# EasyEDA schematic Shield_Amir_EDO_V_0_0.json
TITLE: For EDO (DROP SCREEN exhibit, 3D exhebition); REV: 1.0; Date: 2023-11-01; Sheet: 1/1; Company: Amir BS
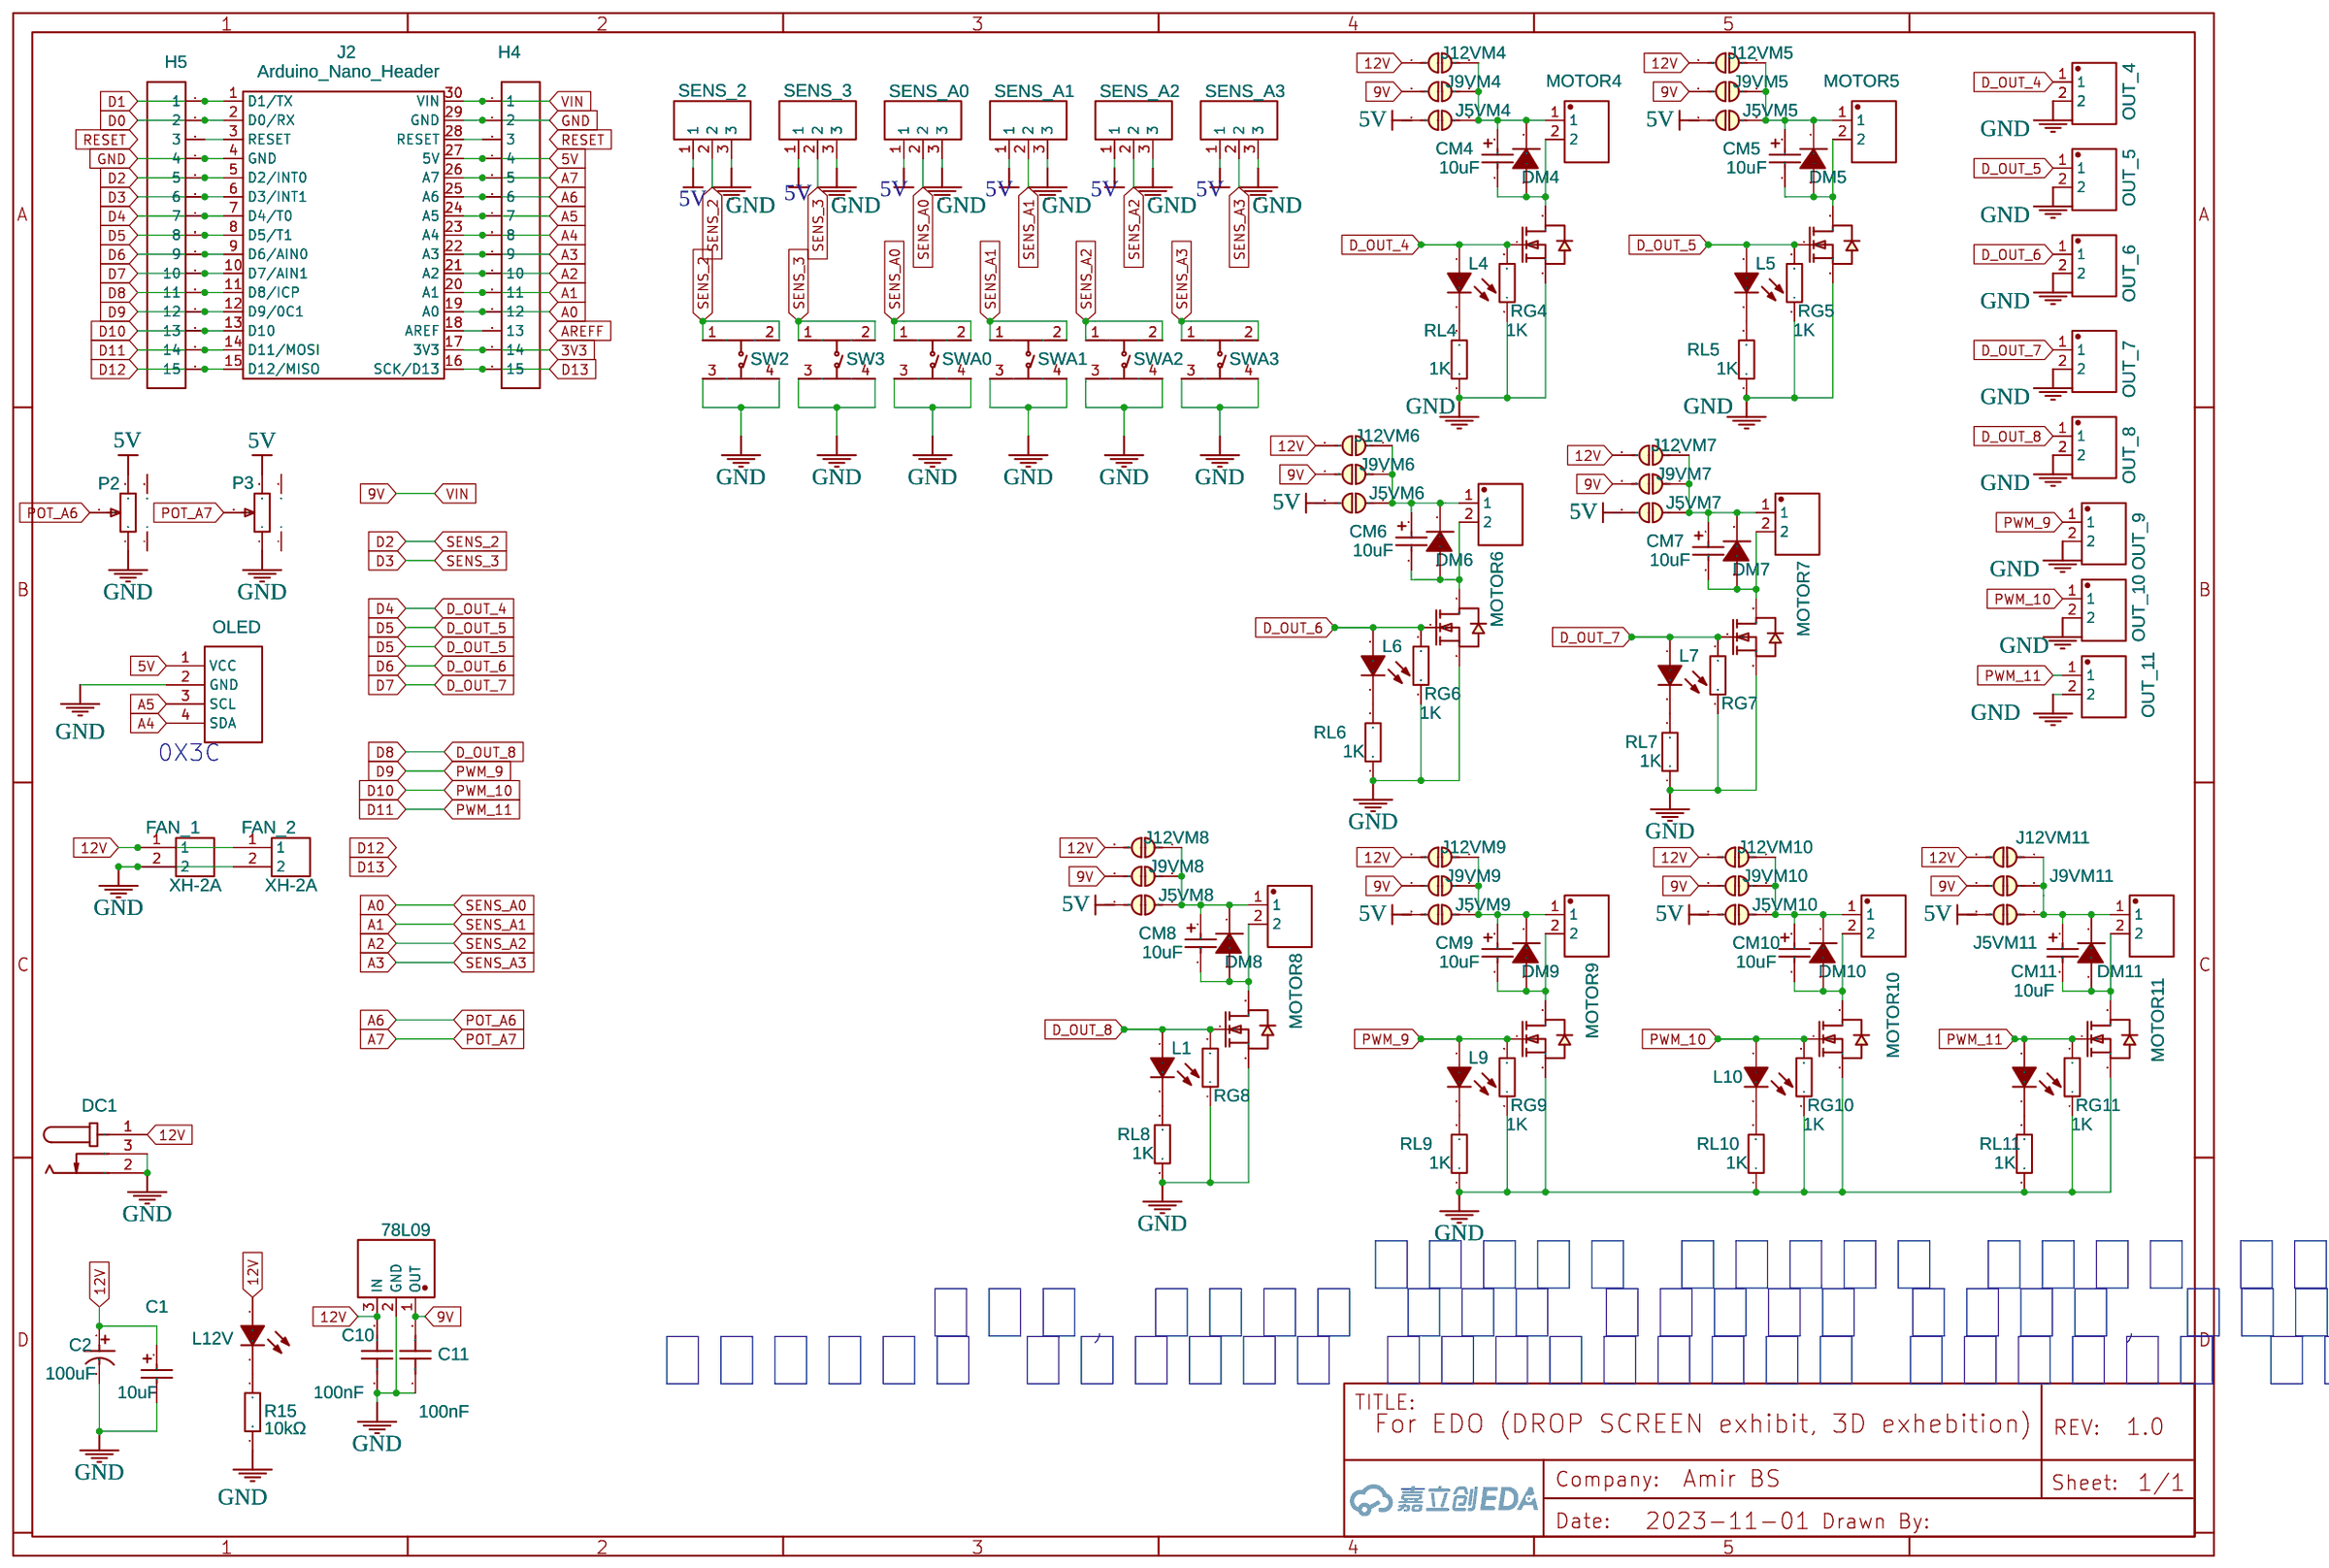
[diagram p0: schematic sheet]

## Parts
C1  10uF  [CAP-SMD_L3.2-W1.6-RD-C7171]
C2  100uF  [CAP-TH_BD6.3-P2.50-D1.0-FD]
C10  100nF  [C0603]
C11  100nF  [C0603]
CM4  10uF  [CAP-SMD_L3.2-W1.6-RD-C7171]
CM5  10uF  [CAP-SMD_L3.2-W1.6-RD-C7171]
CM6  10uF  [CAP-SMD_L3.2-W1.6-RD-C7171]
CM7  10uF  [CAP-SMD_L3.2-W1.6-RD-C7171]
CM8  10uF  [CAP-SMD_L3.2-W1.6-RD-C7171]
CM9  10uF  [CAP-SMD_L3.2-W1.6-RD-C7171]
CM10  10uF  [CAP-SMD_L3.2-W1.6-RD-C7171]
CM11  10uF  [CAP-SMD_L3.2-W1.6-RD-C7171]
DC1  DC  [DC-IN-TH_DC005]
DM4  1N4007  [SMAF_L3.5-W2.6-LS4.7-RD]
DM5  1N4007  [SMAF_L3.5-W2.6-LS4.7-RD]
DM6  1N4007  [SMAF_L3.5-W2.6-LS4.7-RD]
DM7  1N4007  [SMAF_L3.5-W2.6-LS4.7-RD]
DM8  1N4007  [SMAF_L3.5-W2.6-LS4.7-RD]
DM9  1N4007  [SMAF_L3.5-W2.6-LS4.7-RD]
DM10  1N4007  [SMAF_L3.5-W2.6-LS4.7-RD]
DM11  1N4007  [SMAF_L3.5-W2.6-LS4.7-RD]
FAN_1  XH-2A  [CONN-TH_XH-2A]
FAN_2  XH-2A  [CONN-TH_XH-2A]
H4  HDR-F-2.54_1x15  [HDR-F-2.54_1X15]
H5  HDR-F-2.54_1x15  [HDR-F-2.54_1X15]
J2  Arduino_Nano_Header  [DIP-30_L43.18-W15.24-ARDUINONANO]
J5VM4  JUMPER-SMT_2  [JUMPERS_SMT-JUMPER_2_NC_PASTE_NO-SILK]
J5VM5  JUMPER-SMT_2  [JUMPERS_SMT-JUMPER_2_NC_PASTE_NO-SILK]
J5VM6  JUMPER-SMT_2  [JUMPERS_SMT-JUMPER_2_NC_PASTE_NO-SILK]
J5VM7  JUMPER-SMT_2  [JUMPERS_SMT-JUMPER_2_NC_PASTE_NO-SILK]
J5VM8  JUMPER-SMT_2  [JUMPERS_SMT-JUMPER_2_NC_PASTE_NO-SILK]
J5VM9  JUMPER-SMT_2  [JUMPERS_SMT-JUMPER_2_NC_PASTE_NO-SILK]
J5VM10  JUMPER-SMT_2  [JUMPERS_SMT-JUMPER_2_NC_PASTE_NO-SILK]
J5VM11  JUMPER-SMT_2  [JUMPERS_SMT-JUMPER_2_NC_PASTE_NO-SILK]
J9VM4  JUMPER-SMT_2  [JUMPERS_SMT-JUMPER_2_NC_PASTE_NO-SILK]
J9VM5  JUMPER-SMT_2  [JUMPERS_SMT-JUMPER_2_NC_PASTE_NO-SILK]
J9VM6  JUMPER-SMT_2  [JUMPERS_SMT-JUMPER_2_NC_PASTE_NO-SILK]
J9VM7  JUMPER-SMT_2  [JUMPERS_SMT-JUMPER_2_NC_PASTE_NO-SILK]
J9VM8  JUMPER-SMT_2  [JUMPERS_SMT-JUMPER_2_NC_PASTE_NO-SILK]
J9VM9  JUMPER-SMT_2  [JUMPERS_SMT-JUMPER_2_NC_PASTE_NO-SILK]
J9VM10  JUMPER-SMT_2  [JUMPERS_SMT-JUMPER_2_NC_PASTE_NO-SILK]
J9VM11  JUMPER-SMT_2  [JUMPERS_SMT-JUMPER_2_NC_PASTE_NO-SILK]
J12VM4  JUMPER-SMT_2  [JUMPERS_SMT-JUMPER_2_NC_PASTE_NO-SILK]
J12VM5  JUMPER-SMT_2  [JUMPERS_SMT-JUMPER_2_NC_PASTE_NO-SILK]
J12VM6  JUMPER-SMT_2  [JUMPERS_SMT-JUMPER_2_NC_PASTE_NO-SILK]
J12VM7  JUMPER-SMT_2  [JUMPERS_SMT-JUMPER_2_NC_PASTE_NO-SILK]
J12VM8  JUMPER-SMT_2  [JUMPERS_SMT-JUMPER_2_NC_PASTE_NO-SILK]
J12VM9  JUMPER-SMT_2  [JUMPERS_SMT-JUMPER_2_NC_PASTE_NO-SILK]
J12VM10  JUMPER-SMT_2  [JUMPERS_SMT-JUMPER_2_NC_PASTE_NO-SILK]
J12VM11  JUMPER-SMT_2  [JUMPERS_SMT-JUMPER_2_NC_PASTE_NO-SILK]
L1  LED  [LED0603-R-RD_BLUE]
L4  LED  [LED0603-R-RD_BLUE]
L5  LED  [LED0603-R-RD_BLUE]
L6  LED  [LED0603-R-RD_BLUE]
L7  LED  [LED0603-R-RD_BLUE]
L9  LED  [LED0603-R-RD_BLUE]
L10  LED  [LED0603-R-RD_BLUE]
L11  LED  [LED0603-R-RD_BLUE]
L12V  LED  [LED0603-R-RD_BLUE]
MOTOR4  KF2510-2A  [CONN-TH_KF2510-2A]
MOTOR5  KF2510-2A  [CONN-TH_KF2510-2A]
MOTOR6  KF2510-2A  [CONN-TH_KF2510-2A]
MOTOR7  KF2510-2A  [CONN-TH_KF2510-2A]
MOTOR8  KF2510-2A  [CONN-TH_KF2510-2A]
MOTOR9  KF2510-2A  [CONN-TH_KF2510-2A]
MOTOR10  KF2510-2A  [CONN-TH_KF2510-2A]
MOTOR11  KF2510-2A  [CONN-TH_KF2510-2A]
OLED  1.3 inch OLED SSH1106 I2C 128x64 copy  [1.3_OLED_SSH1106_I2C_128X64_BOARD]
OUT_4  KF2510-2A  [CONN-TH_KF2510-2A]
OUT_5  KF2510-2A  [CONN-TH_KF2510-2A]
OUT_6  KF2510-2A  [CONN-TH_KF2510-2A]
OUT_7  KF2510-2A  [CONN-TH_KF2510-2A]
OUT_8  KF2510-2A  [CONN-TH_KF2510-2A]
OUT_9  KF2510-2A  [CONN-TH_KF2510-2A]
OUT_10  KF2510-2A  [CONN-TH_KF2510-2A]
OUT_11  KF2510-2A  [CONN-TH_KF2510-2A]
P2  长柄旋转电位器  [RES-ADJ-TH_RV09]
P3  长柄旋转电位器  [RES-ADJ-TH_RV09]
Q2  Q  [SOT-23-3_L2.9-W1.3-P1.90-LS2.4-BR]
QM4  Q  [SOT-23-3_L2.9-W1.3-P1.90-LS2.4-BR]
QM5  Q  [SOT-23-3_L2.9-W1.3-P1.90-LS2.4-BR]
QM6  Q  [SOT-23-3_L2.9-W1.3-P1.90-LS2.4-BR]
QM7  Q  [SOT-23-3_L2.9-W1.3-P1.90-LS2.4-BR]
QM8  Q  [SOT-23-3_L2.9-W1.3-P1.90-LS2.4-BR]
QM9  Q  [SOT-23-3_L2.9-W1.3-P1.90-LS2.4-BR]
QM10  Q  [SOT-23-3_L2.9-W1.3-P1.90-LS2.4-BR]
R15  10kΩ  [R0603]
RG4  1K  [R0603]
RG5  1K  [R0603]
RG6  1K  [R0603]
RG7  1K  [R0603]
RG8  1K  [R0603]
RG9  1K  [R0603]
RG10  1K  [R0603]
RG11  1K  [R0603]
RL4  1K  [R0603]
RL5  1K  [R0603]
RL6  1K  [R0603]
RL7  1K  [R0603]
RL8  1K  [R0603]
RL9  1K  [R0603]
RL10  1K  [R0603]
RL11  1K  [R0603]
SENS_2  FK2510  [CONN-TH_3P-P2.00_KF2510_3A]
SENS_3  FK2510  [CONN-TH_3P-P2.00_KF2510_3A]
SENS_A0  FK2510  [CONN-TH_3P-P2.00_KF2510_3A]
SENS_A1  FK2510  [CONN-TH_3P-P2.00_KF2510_3A]
SENS_A2  FK2510  [CONN-TH_3P-P2.00_KF2510_3A]
SENS_A3  FK2510  [CONN-TH_3P-P2.00_KF2510_3A]
SW2  TC-6610-7-160G  [SW-TH_4P-L5.0-W5.0-P4.50-LS6.5]
SW3  TC-6610-7-160G  [SW-TH_4P-L5.0-W5.0-P4.50-LS6.5]
SWA0  TC-6610-7-160G  [SW-TH_4P-L5.0-W5.0-P4.50-LS6.5]
SWA1  TC-6610-7-160G  [SW-TH_4P-L5.0-W5.0-P4.50-LS6.5]
SWA2  TC-6610-7-160G  [SW-TH_4P-L5.0-W5.0-P4.50-LS6.5]
SWA3  TC-6610-7-160G  [SW-TH_4P-L5.0-W5.0-P4.50-LS6.5]
U5  78L09  [SOT-89-3_L4.5-W2.5-P1.50-LS4.0-BR]

## Library data of the parts
C1 CM4-CM11 = TAJA106K016RNJ: Supplier: LCSC; Manufacturer: Kyocera AVX; Supplier Part: C7171; JLCPCB Part Class: Basic Part; Package Display: No
C2 = 100uF 35V 6.3*11: Supplier: LCSC; Manufacturer: CX(承兴); Supplier Part: C19504; JLCPCB Part Class: Extended Part; Package Display: No
C10 C11 = CC0603KRX7R9BB104: JLCPCB Part Class: Basic Part; Package Display: No
DC1 = DC005-2.0MM: Supplier: LCSC; Manufacturer: SOFNG; Supplier Part: C111567; Package Display: No
DM4-DM11 = 1N4007F: Supplier: LCSC; Manufacturer: SK; Supplier Part: C110856; JLCPCB Part Class: Extended Part; Package Display: No
FAN_1 FAN_2 = XH-2A: JLCPCB Part Class: Extended Part; Package Display: No
H4 H5 = HDR-F-2.54_1x15: Supplier Part: C124408; Supplier: LCSC; Contributor: LCEDA_Lib; Package Display: No
J2 = Arduino_Nano_Header
J5VM4-J5VM11 J9VM4-J9VM11 J12VM4-J12VM11 = JUMPER-SMT_2: Contributor: P-Thomsen; Package Display: No
L1 L4-L7 L9-L11 L12V = 19-217/BHC-ZL1M2RY/3T: Supplier: LCSC; Manufacturer: EVERLIGHT; Supplier Part: C72041; JLCPCB Part Class: Basic Part; Package Display: No
MOTOR4-MOTOR11 OUT_4-OUT_11 = KF2510-2A: Supplier: LCSC; Manufacturer: BOOMELE; Supplier Part: C27543; JLCPCB Part Class: Extended Part; Package Display: No
OLED = 1.3 inch OLED SSH1106 I2C 128x64 copy: Contributor: Deguello; Package Display: No
P2 P3 = 长柄旋转电位器: Supplier: LCSC; Supplier Part: C2874842; Manufacturer: null; JLCPCB Part Class: Extended Part; Contributor: LCSC; Package Display: No
Q2 QM4-QM10 = JSM2302: Supplier: LCSC; Supplier Part: C916403; Manufacturer: JSMSEMI; Contributor: LCSC; JLCPCB Part Class: Extended Part; Package Display: No
R15 = 0603WAF1002T5E: Supplier: LCSC; Manufacturer: UNI-ROYAL(厚声); Supplier Part: C25804; Resistance (Ohms): 10K; JLCPCB Part Class: Basic Part; Package Display: No
RG4-RG11 RL4-RL11 = 0603WAF1001T5E: Supplier: LCSC; Manufacturer: UniOhm; Supplier Part: C21190; JLCPCB Part Class: Basic Part; Package Display: No
SENS_2 SENS_3 SENS_A0-SENS_A3 = kf2510_3A: JLCPCB Part Class: Extended Part; Package Display: No
SW2 SW3 SWA0-SWA3 = TC-6610-7-160G: Contributor: LCSC; Supplier: LCSC; Supplier Part: C2845252; Manufacturer: HCTL(华灿天禄); JLCPCB Part Class: Extended Part; Package Display: No
U5 = 78L09U 78L09: Contributor: LCSC; Supplier: LCSC; Supplier Part: C2875177; Manufacturer: CBI(创基); JLCPCB Part Class: Extended Part; Package Display: No

## Nets
3V3: H4.14 J2.17(3V3)
5V: H4.4 J2.27(5V) J5VM4.2 J5VM5.2 J5VM6.2 J5VM7.2 J5VM8.2 J5VM9.2 J5VM10.2 J5VM11.2 OLED.1(VCC) P2.3 P3.3 SENS_2.1 SENS_3.1 SENS_A0.1 SENS_A1.1 SENS_A2.1 SENS_A3.1
9V: C11.2 H4.1 J2.30(VIN) J9VM4.2 J9VM5.2 J9VM6.2 J9VM7.2 J9VM8.2 J9VM9.2 J9VM10.2 J9VM11.2 U5.1(OUT)
12V: C1.1 C2.1 C10.2 DC1.1 FAN_1.1 FAN_2.1 J12VM4.2 J12VM5.2 J12VM6.2 J12VM7.2 J12VM8.2 J12VM9.2 J12VM10.2 J12VM11.2 L12V.1(A) U5.3(IN)
GND: C1.2 C2.2 C10.1 C11.1 DC1.2 DC1.3 FAN_1.2 FAN_2.2 H4.2 H5.4 J2.4(GND) J2.29(GND) OLED.2(GND) OUT_4.2 OUT_5.2 OUT_6.2 OUT_7.2 OUT_8.2 OUT_9.2 OUT_10.2 OUT_11.2 P2.1 P3.1 Q2.2(S) QM4.2(S) QM5.2(S) QM6.2(S) QM7.2(S) QM8.2(S) QM9.2(S) QM10.2(S) R15.2 RG4.1 RG5.1 RG6.1 RG7.1 RG8.1 RG9.1 RG10.1 RG11.1 RL4.1 RL5.1 RL6.1 RL7.1 RL8.1 RL9.1 RL10.1 RL11.1 SENS_2.3 SENS_3.3 SENS_A0.3 SENS_A1.3 SENS_A2.3 SENS_A3.3 SW2.3 SW2.4 SW3.3 SW3.4 SWA0.3 SWA0.4 SWA1.3 SWA1.4 SWA2.3 SWA2.4 SWA3.3 SWA3.4 U5.2(GND)
A0: H4.12 J2.19(A0) SENS_A0.2 SWA0.1 SWA0.2
A1: H4.11 J2.20(A1) SENS_A1.2 SWA1.1 SWA1.2
A2: H4.10 J2.21(A2) SENS_A2.2 SWA2.1 SWA2.2
A3: H4.9 J2.22(A3) SENS_A3.2 SWA3.1 SWA3.2
A4: H4.8 J2.23(A4) OLED.4(SDA)
A5: H4.7 J2.24(A5) OLED.3(SCL)
A6: H4.6 J2.25(A6) P2.2
A7: H4.5 J2.26(A7) P3.2
D0: H5.2 J2.2(D0/RX)
D1: H5.1 J2.1(D1/TX)
D2: H5.5 J2.5(D2/INT0) SENS_2.2 SW2.1 SW2.2
D3: H5.6 J2.6(D3/INT1) SENS_3.2 SW3.1 SW3.2
D4: H5.7 J2.7(D4/T0) L4.1(A) OUT_4.1 QM4.1(G) RG4.2
D5: H5.8 J2.8(D5/T1) L5.1(A) OUT_5.1 QM5.1(G) RG5.2
D6: H5.9 J2.9(D6/AIN0) L6.1(A) OUT_6.1 QM6.1(G) RG6.2
D7: H5.10 J2.10(D7/AIN1) L7.1(A) OUT_7.1 QM7.1(G) RG7.2
D8: H5.11 J2.11(D8/ICP) L1.1(A) OUT_8.1 QM8.1(G) RG8.2
D9: H5.12 J2.12(D9/0C1) L9.1(A) OUT_9.1 QM9.1(G) RG9.2
D10: H5.13 J2.13(D10) L10.1(A) OUT_10.1 QM10.1(G) RG10.2
D11: H5.14 J2.14(D11/MOSI) L11.1(A) OUT_11.1 Q2.1(G) RG11.2
D12: H5.15 J2.15(D12/MISO)
D13: H4.15 J2.16(SCK/D13)
Net-(CM4-1): CM4.1 DM4.1(C) J5VM4.1 J9VM4.1 J12VM4.1 MOTOR4.1
Net-(CM4-2): CM4.2 DM4.2(A) MOTOR4.2 QM4.3(D)
Net-(CM5-1): CM5.1 DM5.1(C) J5VM5.1 J9VM5.1 J12VM5.1 MOTOR5.1
Net-(CM5-2): CM5.2 DM5.2(A) MOTOR5.2 QM5.3(D)
Net-(CM6-1): CM6.1 DM6.1(C) J5VM6.1 J9VM6.1 J12VM6.1 MOTOR6.1
Net-(CM6-2): CM6.2 DM6.2(A) MOTOR6.2 QM6.3(D)
Net-(CM7-1): CM7.1 DM7.1(C) J5VM7.1 J9VM7.1 J12VM7.1 MOTOR7.1
Net-(CM7-2): CM7.2 DM7.2(A) MOTOR7.2 QM7.3(D)
Net-(CM8-1): CM8.1 DM8.1(C) J5VM8.1 J9VM8.1 J12VM8.1 MOTOR8.1
Net-(CM8-2): CM8.2 DM8.2(A) MOTOR8.2 QM8.3(D)
Net-(CM9-1): CM9.1 DM9.1(C) J5VM9.1 J9VM9.1 J12VM9.1 MOTOR9.1
Net-(CM9-2): CM9.2 DM9.2(A) MOTOR9.2 QM9.3(D)
Net-(CM10-1): CM10.1 DM10.1(C) J5VM10.1 J9VM10.1 J12VM10.1 MOTOR10.1
Net-(CM10-2): CM10.2 DM10.2(A) MOTOR10.2 QM10.3(D)
Net-(CM11-1): CM11.1 DM11.1(C) J5VM11.1 J9VM11.1 J12VM11.1 MOTOR11.1
Net-(CM11-2): CM11.2 DM11.2(A) MOTOR11.2 Q2.3(D)
Net-(H4-3): H4.3 J2.28(RESET)
Net-(H4-13): H4.13 J2.18(AREF)
Net-(H5-3): H5.3 J2.3(RESET)
Net-(L1-2): L1.2(C) RL8.2
Net-(L4-2): L4.2(C) RL4.2
Net-(L5-2): L5.2(C) RL5.2
Net-(L6-2): L6.2(C) RL6.2
Net-(L7-2): L7.2(C) RL7.2
Net-(L9-2): L9.2(C) RL9.2
Net-(L10-2): L10.2(C) RL10.2
Net-(L11-2): L11.2(C) RL11.2
Net-(L12V-2): L12V.2(C) R15.1

Not connected (* = marked no-connect by the designer): P2 4 5; P3 4 5

## Notes on the sheet
- 0X3C
- כרטיס פיקוד כללי לקריאת חיישנים
- עדו, מוצג מסך טיפות ועוד, תערוכת החופש ליצור
- והפעלת יציאות דיגיטליות לשליטה על משאבות ועוד
